# EasyEDA schematic SCH_Display_LPM027M128B_breakout_2021-11-24.json
TITLE: LPM027M128B Breakout v1; REV: 1.0; Date: 2021-03-04; Sheet: 1/1; Drawn By: Giovanni Bertazzoni
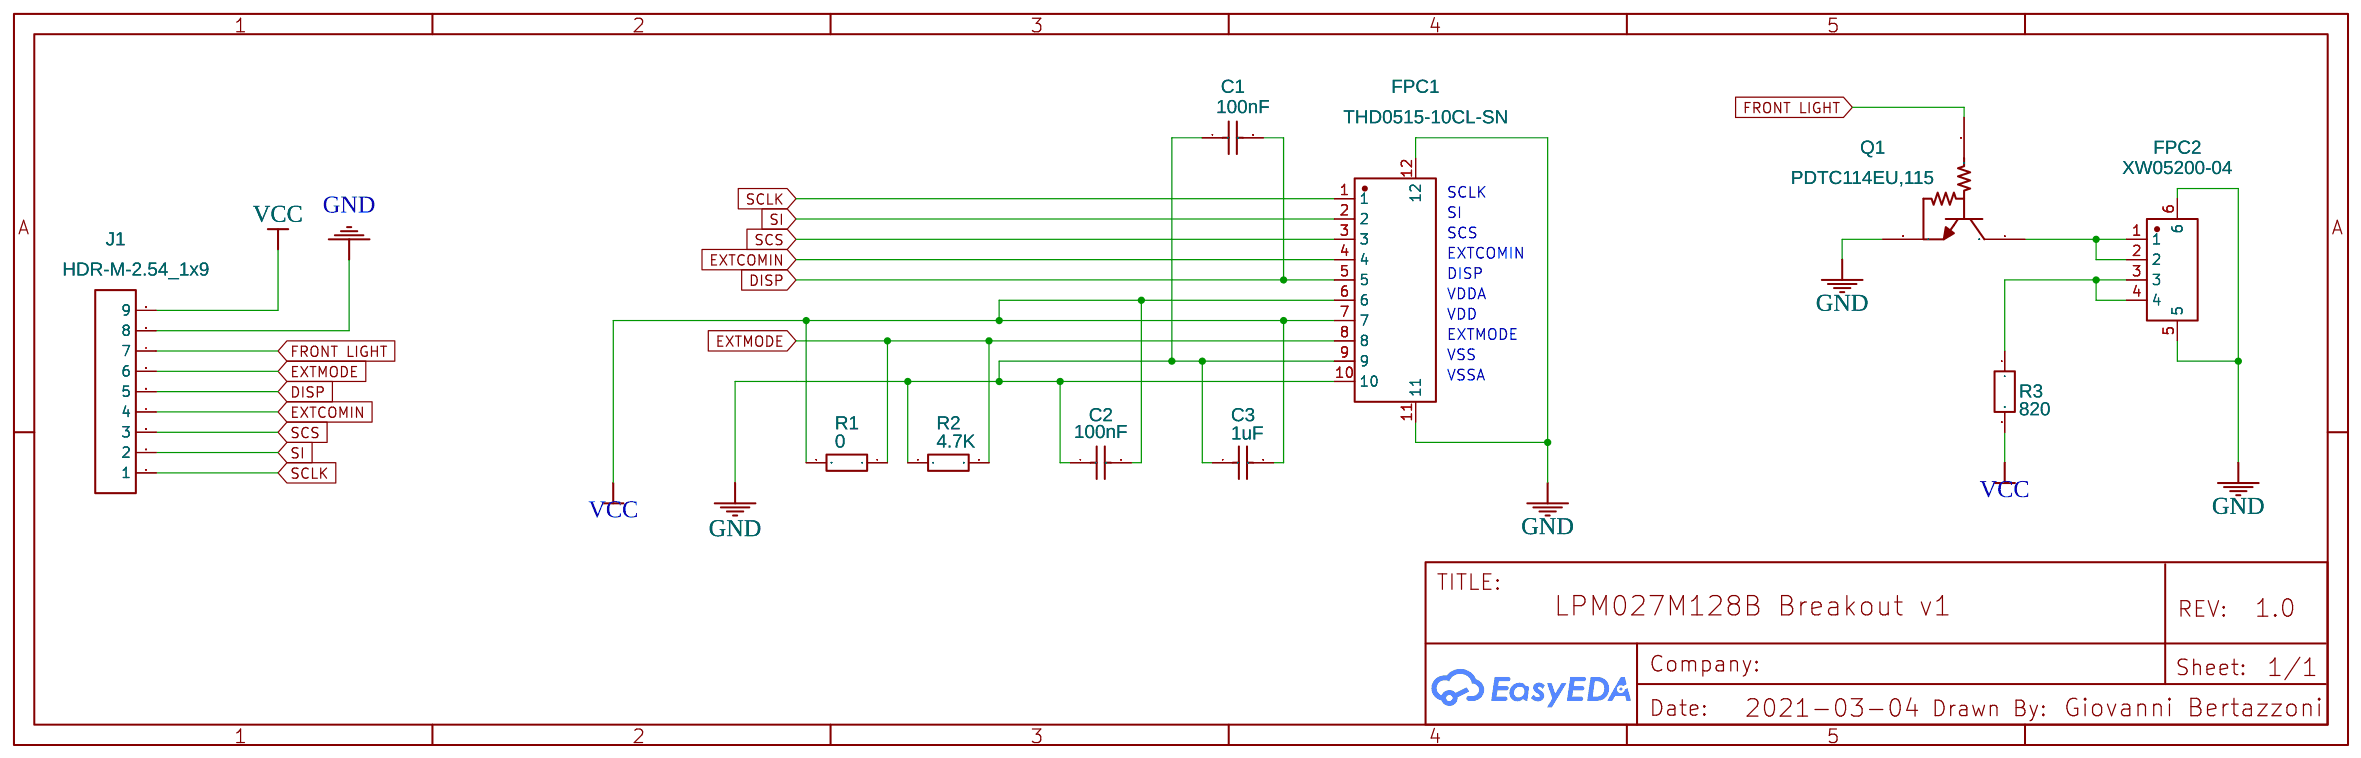
[diagram p0: schematic sheet]

## Parts
C1  100nF  [C0603]
C2  100nF  [C0603]
C3  1uF  [C0805]
FPC1  THD0515-10CL-SN  [FPC-SMD_10P-P0.50_THD0515-10CL-SN]
FPC2  XW05200-04  [FPC-SMD_4P-P0.50_XW05200-04]
J1  HDR-M-2.54_1x9  [HDR-M-2.54_1X9]
Q1  PDTC114EU,115  [SOT-323-3_L2.0-W1.3-P1.30-LS2.1-BR]
R1  0  [R1206]
R2  4.7K  [R0603]
R3  820  [R0805]

## Library data of the parts
C1 C2 = 0603B104K160: Supplier: LCSC; Manufacturer: WTC; Supplier Part: C80516
C3 = CC0805KKX7R7BB105: Supplier: LCSC; Manufacturer: YAGEO; Supplier Part: C94122
FPC1 = THD0515-10CL-SN: Supplier: LCSC; Supplier Part: C283142; Manufacturer: THD; Contributor: LCSC; JLCPCB Part Class: Extended Part
FPC2 = XW05200-04: Supplier: LCSC; Supplier Part: C376056; Manufacturer: MINTRON; Contributor: LCSC; JLCPCB Part Class: Extended Part
J1 = HDR-M-2.54_1x9: Supplier Part: C225484; Supplier: LCSC; Contributor: LCEDA_Lib
Q1 = PDTC114EU,115: Supplier: LCSC; Manufacturer: NXP; Supplier Part: C135830; SMT Type: Extend; JLCPCB SMD: Yes; LCSC Assembly: Yes; Assembly Type: smtWeld; Paste Type: expand
R1 = WR12X0000FTL: Supplier: LCSC; Manufacturer: WALSIN; Contributor: LCSC; Supplier Part: C164015; JLCPCB Part Class: Extended Part
R2 = WR06X472JTL_C163915: Supplier: LCSC; Supplier Part: C163915; Manufacturer: Huaxin S&T; Manufacturer Part: WR06X472JTL; Contributor: LCSC; JLCPCB Part Class: Extended Part
R3 = AS05W2J0821T5E: Supplier: LCSC; Supplier Part: C966098; Manufacturer: UNI-ROYAL(Uniroyal Elec); Contributor: LCSC

## Nets
GND: C1.1 C2.1 C3.1 FPC1.9 FPC1.10 FPC1.11 FPC1.12 FPC2.5 FPC2.6 J1.8 Q1.2(E) R2.1
VCC: C2.2 C3.2 FPC1.6 FPC1.7 J1.9 R1.2 R3.2
DISP: C1.2 FPC1.5 J1.5
EXTCOMIN: FPC1.4 J1.4
EXTMODE: FPC1.8 J1.6 R1.1 R2.2
FRONT LIGHT: J1.7 Q1.1(B)
SCLK: FPC1.1 J1.1
SCS: FPC1.3 J1.3
SI: FPC1.2 J1.2
Net-(FPC2-1): FPC2.1 FPC2.2 Q1.3(C)
Net-(FPC2-3): FPC2.3 FPC2.4 R3.1

## Notes on the sheet
- SCLK
- SI
- SCS
- EXTCOMIN
- DISP
- VDDA
- VDD
- EXTMODE
- VSS
- VSSA
